# Altium project P-MT3620RDB-1-7.PrjPcb (part 4 of 5)
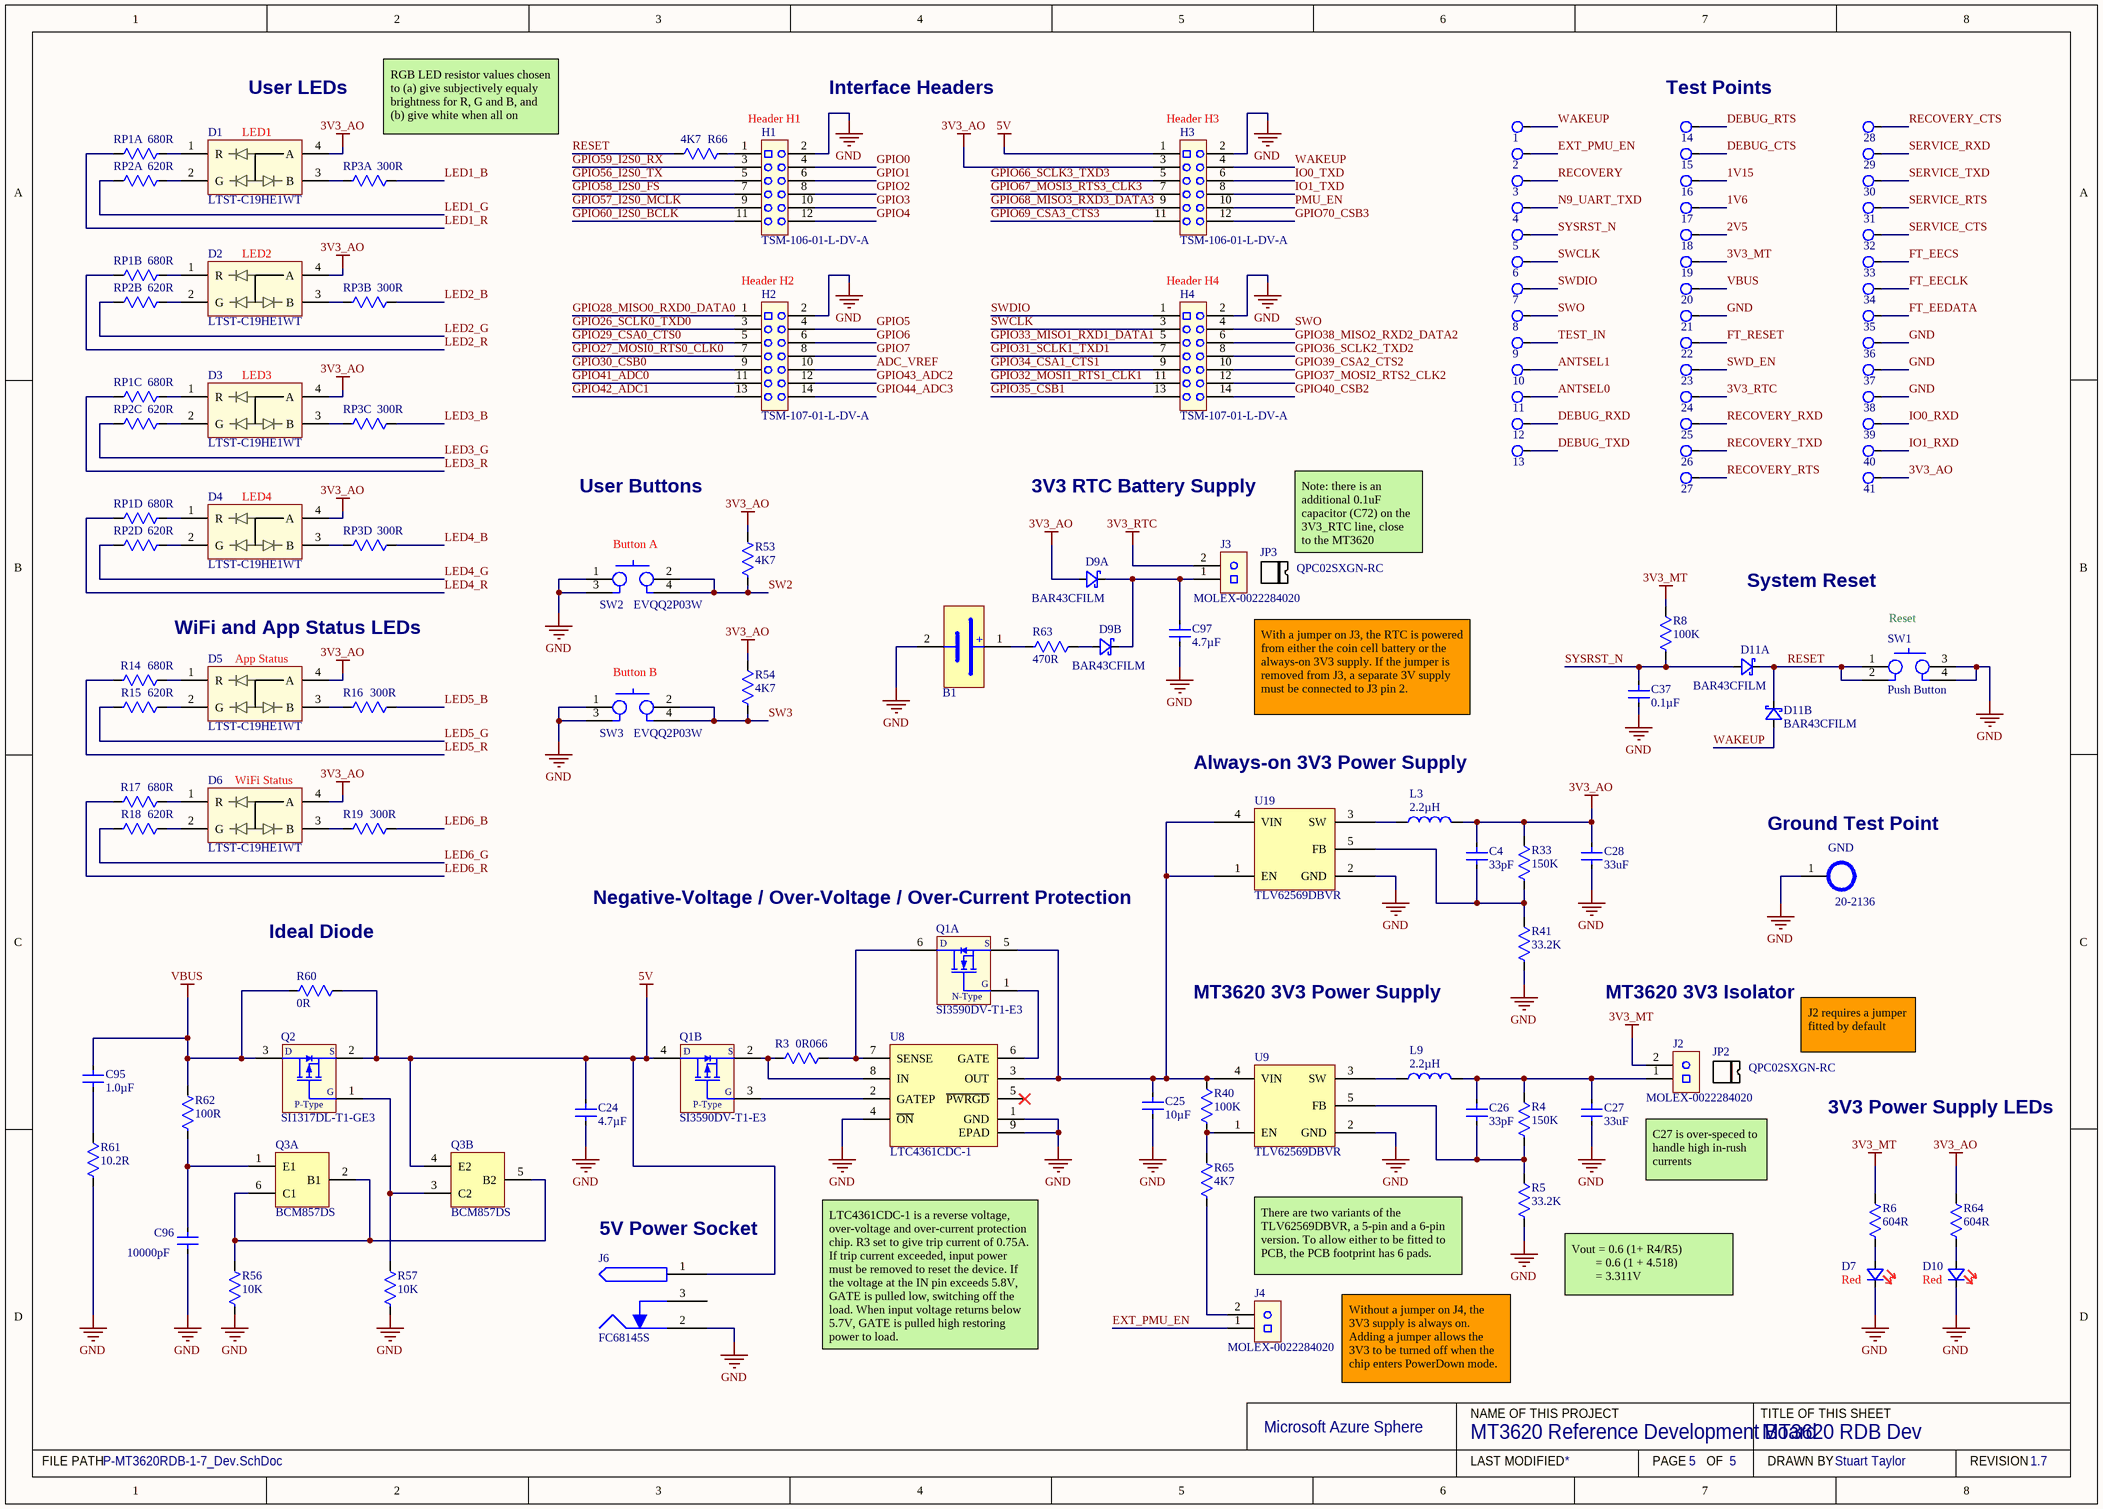
[diagram p6: P-MT3620RDB-1-7_Dev.SchDoc]

## Sheet P-MT3620RDB-1-7_Dev.SchDoc: MT3620 RDB Dev (continued)

### Library data of the parts
1-41 = TestPoint: Test Point
B1 = HARWIN-S8421-45R: SMT CR2032 coin cell holder; Manufacturer: HARWIN; Battery Sizes Accepted: 20; No. of Batteries: 1; Battery Holder Mount: SMD; Battery Terminals: Pressure Contact; SVHC: No SVHC (20-Jun-2013); For Use With: CR2032 Coin Cell Batteries; Battery Type, Function: Coin Cell, Holder; Style: Holder (Open); Battery Cell Size: Coin, 20.0mm; Battery Series: 2032; Supplier 1: Farnell; Manufacturer Part Number: S8421-45R; RoHS: YES; Stock 1: 522; Pricing 1: 1=1.45, 10=1.19, 25=0.98, 50=0.89, 100=0.78 (GBP); Accessory Type: Coin Cell Holder; ComponentLink1URL: http://www.harwin.com/include/downloads/drawings/S8421R.PDF; ComponentLink1Description: http://www.harwin.com/include/downloads/drawings/S8421R.PDF; Supplier Part Number 1: 2115305; Supplier 2: Digi-Key; Category: Battery Products; Stock 2: 3868; Pricing 2: 1=0.69, 10=0.619, 50=0.5498, 100=0.4811, 250=0.43988 (GBP); Number of Cells: 1; Mounting Type: PCB, Surface Mount; Termination Style: SMD (SMT) Tab; Height Above Board: 0.185" (4.70mm); Operating Temperature: -40°C ~ 105°C; ComponentLink2URL: http://harwin.com/includes/pdfs/S8421R.pdf; ComponentLink2Description: http://harwin.com/includes/pdfs/S8421R.pdf; Supplier Part Number 2: 952-1737-1-ND
C4 C26 = 33pF 0402 C0G, NP0 50V: CAP CER 33PF 50V 5% NP0 0402; Manufacturer: TDK Corporation; Manufacturer Part Number: C1005C0G1H330J050BA; Supplier 1: Digi-Key; RoHS: RoHS Compliant; Category: Capacitors; Stock 1: 47833; Pricing 1: 0.00274; Packaging: Tape & Reel (TR); Tolerance: ±5%; Voltage - Rated: 50V; Temperature Coefficient: C0G, NP0; Mounting Type: Surface Mount, MLCC; Operating Temperature: -55°C ~ 125°C; Applications: General Purpose; Package / Case: 0402 (1005 Metric); Size / Dimension: 0.039" L x 0.020" W (1.00mm x 0.50mm); Height - Seated (Max): -; Thickness (Max): 0.022" (0.55mm); Lead Spacing: -; Features: -; Lead Style: -; ComponentLink1URL: http://product.tdk.com/en/catalog/datasheets/mlcc_commercial_general_en.pdf; ComponentLink1Description: http://product.tdk.com/en/catalog/datasheets/mlcc_commercial_general_en.pdf; Supplier Part Number 1: 445-1241-2-ND; Ratings: -; Capacitance: 33pF
C24 C97 = 4.7µF 0402 X5R 10V: CAP CER 4.7UF 10V 10% X5R 0402; Manufacturer: TDK Corporation; Manufacturer Part Number: C1005X5R1A475K050BC; Supplier 1: Digi-Key; RoHS: RoHS Compliant; Category: Capacitors; Stock 1: 47833; Pricing 1: 0.06265; Packaging: Tape & Reel (TR); Tolerance: ±10%; Voltage - Rated: 10V; Temperature Coefficient: X5R; Mounting Type: Surface Mount, MLCC; Operating Temperature: -55°C ~ 125°C; Applications: General Purpose; Package / Case: 0402 (1005 Metric); Size / Dimension: 0.039" L x 0.020" W (1.00mm x 0.50mm); Height - Seated (Max): -; Thickness (Max): 0.022" (0.55mm); Lead Spacing: -; Features: -; Lead Style: -; ComponentLink1URL: http://product.tdk.com/en/catalog/datasheets/mlcc_commercial_general_en.pdf; ComponentLink1Description: http://product.tdk.com/en/catalog/datasheets/mlcc_commercial_general_en.pdf; Supplier Part Number 1: 445-13820-2-ND; Ratings: -; Capacitance: 4.7µF
C25 = 10µF 0603 X5R 25V: CAP CER 10UF 25V 20% X5R 0603; Manufacturer: TDK Corporation; Manufacturer Part Number: C1608X5R1E106M080AC; Supplier 1: Digi-Key; RoHS: RoHS Compliant; Category: Capacitors; Stock 1: 47833; Pricing 1: 0.00754; Packaging: Tape & Reel (TR); Tolerance: ±20%; Voltage - Rated: 25V; Temperature Coefficient: X5R; Mounting Type: Surface Mount, MLCC; Operating Temperature: -55°C ~ 125°C; Applications: General Purpose; Package / Case: 0603 (1608 Metric); Size / Dimension: 0.063" L x 0.031" W (1.60mm x 0.80mm); Height - Seated (Max): -; Thickness (Max): 0.039" (1.00mm); Lead Spacing: -; Features: -; Lead Style: -; ComponentLink1URL: http://product.tdk.com/en/catalog/datasheets/mlcc_commercial_general_en.pdf; ComponentLink1Description: http://product.tdk.com/en/catalog/datasheets/mlcc_commercial_general_en.pdf; Supplier Part Number 1: 445-9015-2-ND; Ratings: -; Capacitance: 10µF
C27 C28 = 33uF 0805 X5R 6.3V: CAP CER 33UF 6.3V X5R 0805; Manufacturer: TDK; Manufacturer Part Number: C2012X5R0J336M125AC; Dielectric Material: Ceramic; Tolerance: 20%; Supplier 1: Digi-Key; Stock 1: 11984; Pricing 1: 1=0.87, 10=0.658, 100=0.4706, 500=0.3643, 1000=0.3137 (USD); Mount: Surface Mount; Case/Package: 0805; Weight: 0.000194oz; Case Code (Imperial): 0805; Case Code (Metric): 2012; Min Operating Temperature: -55°C; Max Operating Temperature: 85°C; Capacitance: 33uF; Voltage Rating (DC): 6.3V; Packaging: Tape and Reel; Package Quantity: 1; Voltage Rating: 6.3V; Dielectric: X5R; Termination: SMD/SMT; Composition: Ceramic; Length: 2mm; Height: 1.25mm; Width: 1.2mm; Thickness: 0.057inch; Depth: 1.25mm; Radiation Hardening: No; REACH SVHC: No SVHC; Lead Free: Lead Free; ComponentLink1URL: https://datasheet.ciiva.com/24217/c2012x5r0j336m125ac-265107-24217265.pdf; ComponentLink1Description: https://datasheet.ciiva.com/24217/c2012x5r0j336m125ac-265107-24217265.pdf; ComponentLink2URL: https://datasheet.ciiva.com/17487/e412-c-17487404.pdf; ComponentLink2Description: https://datasheet.ciiva.com/17487/e412-c-17487404.pdf; ComponentLink3URL: https://datasheet.ciiva.com/6285/tdkmlcccaprange-6285867.pdf; ComponentLink3Description: https://datasheet.ciiva.com/6285/tdkmlcccaprange-6285867.pdf; ComponentLink4URL: https://datasheet.ciiva.com/6285/tdkmlcccaprange-6285863.pdf; ComponentLink4Description: https://datasheet.ciiva.com/6285/tdkmlcccaprange-6285863.pdf; Supplier Part Number 1: 445-5986-6-ND
C37 = 0.1µF 0402 X7R 50V: CAP CER 0.1UF 50V 10% X7R 0402; Manufacturer: TDK Corporation; Manufacturer Part Number: C1005X7R1H104K050BB; Supplier 1: Digi-Key; RoHS: RoHS Compliant; Category: Capacitors; Stock 1: 47833; Pricing 1: 0.01305; Packaging: Tape & Reel (TR); Tolerance: ±10%; Voltage - Rated: 50V; Temperature Coefficient: X7R; Mounting Type: Surface Mount, MLCC; Operating Temperature: -55°C ~ 125°C; Applications: General Purpose; Package / Case: 0402 (1005 Metric); Size / Dimension: 0.039" L x 0.020" W (1.00mm x 0.50mm); Height - Seated (Max): -; Thickness (Max): 0.022" (0.55mm); Lead Spacing: -; Features: -; Lead Style: -; ComponentLink1URL: http://product.tdk.com/en/catalog/datasheets/mlcc_commercial_general_en.pdf; ComponentLink1Description: http://product.tdk.com/en/catalog/datasheets/mlcc_commercial_general_en.pdf; Supplier Part Number 1: 445-5932-2-ND; Ratings: -; Capacitance: 0.1µF
C95 = 1.0µF 0402 X5R 35V: CAP CER 1UF 35V 10% X5R 0402; Manufacturer: TDK Corporation; Manufacturer Part Number: C1005X5R1V105K050BC; Supplier 1: Digi-Key; RoHS: RoHS Compliant; Category: Capacitors; Stock 1: 47833; Pricing 1: 0.0186; Packaging: Tape & Reel (TR); Tolerance: ±10%; Voltage - Rated: 35V; Temperature Coefficient: X5R; Mounting Type: Surface Mount, MLCC; Operating Temperature: -55°C ~ 125°C; Applications: General Purpose; Package / Case: 0402 (1005 Metric); Size / Dimension: 0.039" L x 0.020" W (1.00mm x 0.50mm); Height - Seated (Max): -; Thickness (Max): 0.022" (0.55mm); Lead Spacing: -; Features: -; Lead Style: -; ComponentLink1URL: http://product.tdk.com/en/catalog/datasheets/mlcc_commercial_general_en.pdf; ComponentLink1Description: http://product.tdk.com/en/catalog/datasheets/mlcc_commercial_general_en.pdf; Supplier Part Number 1: 445-9073-2-ND; Ratings: -; Capacitance: 1.0µF
C96 = 10000pF 0402 X7R 50V: CAP CER 10000PF 50V 10% X7R 0402; Manufacturer: TDK Corporation; Manufacturer Part Number: C1005X7R1H103K050BB; Supplier 1: Digi-Key; RoHS: RoHS Compliant; Category: Capacitors; Stock 1: 47833; Pricing 1: 0.00685; Packaging: Tape & Reel (TR); Tolerance: ±10%; Voltage - Rated: 50V; Temperature Coefficient: X7R; Mounting Type: Surface Mount, MLCC; Operating Temperature: -55°C ~ 125°C; Applications: General Purpose; Package / Case: 0402 (1005 Metric); Size / Dimension: 0.039" L x 0.020" W (1.00mm x 0.50mm); Height - Seated (Max): -; Thickness (Max): 0.022" (0.55mm); Lead Spacing: -; Features: -; Lead Style: -; ComponentLink1URL: http://product.tdk.com/en/catalog/datasheets/mlcc_commercial_general_en.pdf; ComponentLink1Description: http://product.tdk.com/en/catalog/datasheets/mlcc_commercial_general_en.pdf; Supplier Part Number 1: 445-6850-2-ND; Ratings: -; Capacitance: 10000pF
D1-D6 = LTST-C19HE1WT: LED RGB DIFFUSED 0606 SMD; Manufacturer: Lite-On Inc.; Color: Red, Green, Blue (RGB); Lens Color: White; Millicandela Rating: 112.5mcd Red, 281mcd Green, 104mcd Blue; Lens Style/Size: Rectangle with Flat Top, 1.15mm x 1.60mm; Voltage - Forward (Vf) (Typ): 2.1V Red, 3.35V Green, 3.35V Blue; Current - Test: 20mA Red, 20mA Green, 20mA Blue; Viewing Angle: 130°; Wavelength - Dominant: 624nm Red, 525nm Green, 470nm Blue; Wavelength - Peak: 632nm Red, 520nm Green, 468nm Blue; Supplier 1: Digi-Key; Manufacturer Part Number: LTST-C19HE1WT; RoHS: RoHS Compliant; Category: Optoelectronics; Stock 1: 464778; Pricing 1: 1=0.45, 10=0.32, 25=0.2616, 100=0.2093, 250=0.17664, 500=0.15048, 1000=0.11776 (GBP); Packaging: Cut Tape (CT); Part Status: Active; Lens Transparency: Diffused; Mounting Type: Surface Mount; Features: -; Package / Case: 0606 (1616 Metric); Supplier Device Package: *; Size / Dimension: 1.60mm L x 1.60mm W; Height (Max): 0.35mm; ComponentLink1URL: http://optoelectronics.liteon.com/upload/download/DS22-2008-0044/S_110_LTST-C19HE1WT.pdf; ComponentLink1Description: http://optoelectronics.liteon.com/upload/download/DS22-2008-0044/S_110_LTST-C19HE1WT.pdf; Supplier Part Number 1: 160-2162-1-ND
D7 D10 = SML-D12U: 1.6 x 0.8 x 0.55mm (0603) LED 620nm Red; Manufacturer: Rohm Semiconductor; Manufacturer Part Number: SML-D12U8WT86; Millicandela Rating: 63mcd; Voltage - Forward (Vf) (Typ): 2.2V; Current - Test: 20mA; Lens Type: Diffused, White; Lens Style/Size: Rectangle with Flat Top, 1.2mm x 0.8mm; Supplier 1: Digi-Key; RoHS: RoHS Compliant; Category: Optoelectronics; Stock 1: 5722; Pricing 1: 1=0.38, 10=0.279, 25=0.2232, 100=0.1478, 250=0.1046, 500=0.08926, 1000=0.06974 (GBP); Packaging: Cut Tape (CT); Wavelength - Dominant: 620nm; Wavelength - Peak: -; Viewing Angle: -; Package / Case: 0603 (1608 Metric); Size / Dimension: 1.60mm L x 0.80mm W; Height: 0.55mm; Mounting Type: Surface Mount; Luminous Flux @ Current - Test: -; ComponentLink1URL: http://rohmfs.rohm.com/en/products/databook/datasheet/opto/led/chip_mono/sml-d1.pdf; ComponentLink1Description: http://rohmfs.rohm.com/en/products/databook/datasheet/opto/led/chip_mono/sml-d1.pdf; Supplier 2: Farnell; Supplier Part Number 1: 511-1580-1-ND; Supplier Part Number 2: 1685094
D9 D11 = BAR43CFILM: DIODE ARRAY SCHOTTKY 30V SOT23-3; Manufacturer: STMicroelectronics; Element Configuration: Common Cathode; Forward Current: 100mA; Peak Reverse Current: 500nA; Forward Voltage: 1V; Reverse Recovery Time: 5ns; Max Forward Surge Current (Ifsm): 750mA; Power Dissipation: 250mW; Capacitance: 7pF; Supplier 1: Farnell; Manufacturer Part Number: BAR43CFILM; Stock 1: 0; Mount: Surface Mount; Case/Package: SOT-23; Number of Pins: 3; Weight: 0.01lb; Contact Plating: Matte,Tin; Min Operating Temperature: -65°C; Max Operating Temperature: 150°C; Packaging: Tape and Reel; Package Quantity: 3000; Max Repetitive Reverse Voltage (Vrrm): 30V; Average Rectified Current: 100mA; Termination: SMD/SMT; Peak Non-Repetitive Surge Current: 750mA; Current Rating: 100mA; Voltage Rating (DC): 30V; Max Reverse Voltage (DC): 30V; Length: 2.9mm; Height: 0.95mm; Width: 3.05mm; Radiation Hardening: No; REACH SVHC: No SVHC; Lead Free: Lead Free; ComponentLink1URL: http://www.farnell.com/datasheets/1700360.pdf; ComponentLink1Description: http://www.farnell.com/datasheets/1700360.pdf; ComponentLink2URL: http://www.jameco.com/Jameco/Products/ProdDS/869700.pdf; ComponentLink2Description: http://www.jameco.com/Jameco/Products/ProdDS/869700.pdf; ComponentLink3URL: http://www.alliedelec.com/images/products/datasheets/bm/STMICROELECTRONICS/70013844.pdf; ComponentLink3Description: http://www.alliedelec.com/images/products/datasheets/bm/STMICROELECTRONICS/70013844.pdf; ComponentLink4URL: http://www.farnell.com/datasheets/1837092.pdf; ComponentLink4Description: http://www.farnell.com/datasheets/1837092.pdf; ComponentLink5URL: http://www.st.com/content/ccc/resource/technical/document/datasheet/b3/b4/6e/ab/17/40/40/62/CD00000764.pdf/files/CD00000764.pdf/jcr:content/translations/en.CD00000764.pdf; ComponentLink5Description: http://www.st.com/content/ccc/resource/technical/document/datasheet/b3/b4/6e/ab/17/40/40/62/CD00000764.pdf/files/CD00000764.pdf/jcr:content/translations/en.CD00000764.pdf; ComponentLink6URL: http://www.st.com/web/en/resource/technical/document/datasheet/CD00000764.pdf; ComponentLink6Description: http://www.st.com/web/en/resource/technical/document/datasheet/CD00000764.pdf; Supplier Part Number 1: 1562326RL
GND = 20-2136: VERO - 20-2136 - TERMINAL, PCB, BLACK, PK100; Product Range: Type 8 Series; Connector Mounting: Through Hole Mount; Mounting Hole Dia: 1.32; SVHC: No SVHC (17-Dec-2015); Body Height Max: 3.1; Body Height Min: 2.9; External Length / Height: 8.7; Lead Length: 3.4; Panel Thickness: 1.6mm<!--FANDB--><div class="features-and-benefits-container"><div class="features-and-benefits-description"><span class="features-benefits-value">The 20-2136 from Vero is a black bead terminal assembly for 1.32mm hole size. This PCB test point is used for attaching leads to test scopes and probes with scintered glass insulator. The compliant pin design allows terminal to be inserted without damaging hole plating. The terminal will remain in place even when the board is inverted for soldering. The sintered glass bead has a recommended maximum working temperature of 475°C. This exceeds all current standard temperature profile requirements.</span></div><div class="features-and-benefits-list"><ul class="features-and-benefits-list-list"><li class="features-and-benefits-list-item">Used for 1.6; Supplier 1: Farnell; Manufacturer: VERO; Manufacturer Part Number: 20-2136; RoHS: YES; Stock 1: 960; Pricing 1: 100=0.1129, 500=0.1073, 1000=0.1016, 5000=0.096, 10000=0.0903 (GBP); Connector Colour: Black; Contact Material: Phosphor Bronze; Contact Plating: Tin Plated Contacts; Colour: Black; Material: Glass; PCB Hole Diameter: 1.32; ComponentLink1URL: http://www.farnell.com/datasheets/1697168.pdf; ComponentLink1Description: http://www.farnell.com/datasheets/1697168.pdf; Supplier Part Number 1: 8731195
H1 H3 = TSM-106-01-L-DV-A: CONN HEADER 12POS .100" SMD GOLD; Manufacturer: Samtec; Number of Contacts: 12; Connector Type: Solder; Gender: Male; Max Current Rating: 7A; Max Voltage Rating (AC): 475V; Pitch: 2.54mm; Supplier 1: Digi-Key; Manufacturer Part Number: TSM-106-01-L-DV-A; Stock 1: 294; Pricing 1: 1=1.92, 10=1.74, 100=1.491, 500=1.2425, 1000=1.065, 5000=0.9443, 10000=0.923 (USD); Case/Package: SMD/SMT; Contact Plating: Nickel,Gold; Contact Material: Bronze; Housing Colour: Black; Housing Material: Polymer; Min Operating Temperature: -55°C; Max Operating Temperature: 125°C; Number of Rows: 2; Termination: Solder; Packaging: Rail/Tube; Orientation: Straight; Length: 15.24mm; Depth: 5.08mm; Radiation Hardening: No; Lead Free: Lead Free; ComponentLink1URL: http://components.arrow.com/part/dataview/0323_01322952; ComponentLink1Description: http://components.arrow.com/part/dataview/0323_01322952; ComponentLink2URL: http://www.samtec.com/documents/webfiles/pdf/TSM.PDF; ComponentLink2Description: http://www.samtec.com/documents/webfiles/pdf/TSM.PDF; Supplier Part Number 1: SAM12240-ND
H2 H4 = TSM-107-01-L-DV-A: CONN HEADER 14POS .100" SMD GOLD; Manufacturer: Samtec; Number of Contacts: 14; Connector Type: Male Pin; Max Current Rating: 7A; Max Voltage Rating (AC): 475V; Pitch: 2.54mm; Row Spacing: 0.1inch; Supplier 1: Digi-Key; Manufacturer Part Number: TSM-107-01-L-DV-A; Stock 1: 450; Pricing 1: 1=2.14, 10=1.938, 100=1.6611, 500=1.3843, 1000=1.1865, 5000=1.052 (USD); Mount: Surface Mount; Case/Package: 100; Contact Plating: Nickel,Gold; Contact Material: Bronze; Housing Colour: Black; Housing Material: Polymer; Colour: Black; Min Operating Temperature: -55°C; Max Operating Temperature: 125°C; Number of Rows: 2; Termination: Solder; Packaging: Rail/Tube; Orientation: Straight; Number of Positions: 14; Length: 17.78mm; Depth: 5.08mm; Contact Mating Length: 0.23inch; Lead Free: Lead Free; ComponentLink1URL: https://datasheet.ciiva.com/739/tsm-1xx-xx-xxx-xx-x-xxx-x-mkt-739691.pdf; ComponentLink1Description: https://datasheet.ciiva.com/739/tsm-1xx-xx-xxx-xx-x-xxx-x-mkt-739691.pdf; Supplier Part Number 1: SAM10809-ND
J2-J4 = MOLEX-0022284020: CONN HEADER 2POS .100 VERT TIN; Manufacturer: Molex, LLC; Connector Type: Header, Unshrouded, Breakaway; Number of Positions: 2; Number of Positions Loaded: All; Pitch: 0.100" (2.54mm); Supplier 1: Digi-Key; Manufacturer Part Number: 0022284020; RoHS: RoHS Compliant; Category: Connectors, Interconnects; Stock 1: 10077; Pricing 1: 1=0.12, 10=0.108, 25=0.0808, 50=0.0692, 100=0.0668, 250=0.0576, 500=0.0553 (GBP); Packaging: Bulk; Contact Type: Male Pin; Number of Rows: 1; Row Spacing: -; Contact Mating Length: 0.240" (6.10mm); Mounting Type: Through Hole; Termination: Solder; Fastening Type: -; Features: -; Contact Finish: Tin; Contact Finish Thickness: 100µin (2.54µm); Color: Black; ComponentLink1URL: http://www.molex.com/pdm_docs/sd/022284020_sd.pdf; ComponentLink1Description: http://www.molex.com/pdm_docs/sd/022284020_sd.pdf; Supplier Part Number 1: WM50014-02-ND
J6 = FC68145S: CLIFF ELECTRONIC COMPONENTS, FC68145S, DC Power Connector, Jack, 1 A, 1.3 mm, Surface Mount; Current Rating: 1A; Pin Diameter: 1.3mm; Barrel Outer Diameter: 3.7mm; Voltage Rating: 12V; SVHC: No SVHC (17-Dec-2015); Supplier 1: Farnell; Manufacturer: Cliff; Manufacturer Part Number: FC68145S; Stock 1: 1068; Pricing 1: 1=1.87, 25=1.17, 50=0.917, 150=0.823, 250=0.736, 500=0.674, 1500=0.571, 2500=0.509 (EUR); Gender: Jack; Barrel Length: -; Connector Mounting: Surface Mount; Contact Termination Type: Surface Mount; Barrel Inner Diameter: -; Product Range: -; ComponentLink1URL: https://datasheet.ciiva.com/6838/1303385-6838100.pdf; ComponentLink1Description: https://datasheet.ciiva.com/6838/1303385-6838100.pdf; ComponentLink2URL: https://datasheet.ciiva.com/7653/1864271-7653766.pdf; ComponentLink2Description: https://datasheet.ciiva.com/7653/1864271-7653766.pdf; Supplier Part Number 1: 1889307
JP2 JP3 = QPC02SXGN-RC: CONN JUMPER SHORTING .100" GOLD; Manufacturer: Sullins; Number of Positions: 2; Pitch: 0.1inch; Supplier 1: Digi-Key; Manufacturer Part Number: QPC02SXGN-RC; RoHS: Yes; Category: Connectors; Stock 1: 717508; Pricing 1: 1=0.10000, 10=0.05900, 25=0.04400, 50=0.03780, 100=0.03650, 250=0.03152, 500=0.03024, 1000=0.02646, 2500=0.02394 (USD); Case/Package: 100; Contact Plating: Gold; Package Quantity: 2000; Packaging: Bulk; Height: 0.235inch; Lead Free: Lead Free; ComponentLink1URL: https://datasheet.ciiva.com/767/284-sxgn-11510-767869.pdf?src-supplier=Digi-Key; ComponentLink1Description: https://datasheet.ciiva.com/767/284-sxgn-11510-767869.pdf?src-supplier=Digi-Key; Supplier Part Number 1: S9337-ND
L3 L9 = NR3015T2R2M: FIXED IND 2.2UH 1.5A 72 MOHM SMD; Manufacturer: Taiyo Yuden; Type: Wirewound; Material - Core: Ferrite; Tolerance: ±20%; Current - Saturation: 1.48A; Shielding: Shielded; DC Resistance (DCR): 72 mOhm Max; Frequency - Self Resonant: 64MHz; Frequency - Test: 100kHz; Supplier 1: Digi-Key; Manufacturer Part Number: NR3015T2R2M; RoHS: RoHS Compliant; Category: Inductors, Coils, Chokes; Stock 1: 150589; Pricing 1: 1=0.23, 10=0.209, 25=0.1864, 50=0.163, 100=0.1513, 250=0.13964, 500=0.13268, 1000=0.10707 (GBP); Packaging: Cut Tape (CT); Inductance: 2.2µH; Current Rating: 1.5A; Q @ Freq: -; Ratings: -; Operating Temperature: -25°C ~ 120°C; Mounting Type: Surface Mount; Package / Case: Nonstandard; Size / Dimension: 0.118" L x 0.118" W (3.00mm x 3.00mm); Height - Seated (Max): 0.059" (1.50mm); ComponentLink1URL: http://ds.yuden.co.jp/TYCOMPAS/ut/detail.do?productNo=NR3015T2R2M&fileName=NR3015T2R2M_SS&mode=specSheetDownload; ComponentLink1Description: http://ds.yuden.co.jp/TYCOMPAS/ut/detail.do?productNo=NR3015T2R2M&fileName=NR3015T2R2M_SS&mode=specSheetDownload; Supplier Part Number 1: 587-1648-1-ND
Q1 = SI3590DV-T1-E3: MOSFET N&P-CH 30V (D-S); Manufacturer: Vishay Siliconix; Nominal Vgs: 600mV; Rds On Max: 77mR; Rise Time: 15ns; Continuous Drain Current (ID): 2.5A; Max Power Dissipation: 830mW; Drain to Source Resistance: 170mR; Gate to Source Voltage (Vgs): 12V; Turn-Off Delay Time: 20ns; Number of Elements: 2; Turn-On Delay Time: 5ns; Supplier 1: Digi-Key; Manufacturer Part Number: SI3590DV-T1-E3; Stock 1: 43293; Pricing 1: 1=0.71, 10=0.612, 25=0.5712, 100=0.4568, 250=0.4242, 500=0.3589, 1000=0.2774 (USD); Mount: Surface Mount; Case/Package: TSOP; Number of Pins: 6; Weight: 0.000705oz; Min Operating Temperature: -55°C; Max Operating Temperature: 150°C; Packaging: Tape and Reel; Package Quantity: 3000; Drain to Source Voltage (Vdss): 30V; Drain to Source Breakdown Voltage: 30V; Fall Time: 15ns; Power Dissipation: 830mW; Number of Channels: 2; Length: 3.05mm; Height: 1mm; Width: 1.65mm; Radiation Hardening: No; REACH SVHC: Unknown; Lead Free: Lead Free; ComponentLink1URL: https://datasheet.ciiva.com/4441/72032-244663-4441688.pdf; ComponentLink1Description: https://datasheet.ciiva.com/4441/72032-244663-4441688.pdf; ComponentLink2URL: https://datasheet.ciiva.com/11158/72032-11158835.pdf; ComponentLink2Description: https://datasheet.ciiva.com/11158/72032-11158835.pdf; ComponentLink3URL: https://datasheet.ciiva.com/6388/72032-6388120.pdf; ComponentLink3Description: https://datasheet.ciiva.com/6388/72032-6388120.pdf; ComponentLink4URL: https://datasheet.ciiva.com/6388/72032-6388117.pdf; ComponentLink4Description: https://datasheet.ciiva.com/6388/72032-6388117.pdf; ComponentLink5URL: https://datasheet.ciiva.com/26145/72032-26145319.pdf; ComponentLink5Description: https://datasheet.ciiva.com/26145/72032-26145319.pdf; Supplier Part Number 1: SI3590DV-T1-E3DKR-ND
Q2 = SI1317DL-T1-GE3: VISHAY SI1317DL-T1-GE3 MOSFET Transistor, P Channel, -1.4 A, -20 V, 0.125 ohm, -4.5 V, 450 mV; Manufacturer: Vishay Siliconix; Rds On Max: 150mR; Input Capacitance: 272pF; Rise Time: 30ns; Drain to Source Voltage (Vdss): 20V; Continuous Drain Current (ID): 1.4A; Max Power Dissipation: 500mW; Number of Channels: 1; Drain to Source Resistance: 270mR; Gate to Source Voltage (Vgs): 8V; Fall Time: 18ns; Turn-Off Delay Time: 23ns; Turn-On Delay Time: 12ns; Threshold Voltage: 450mV; Power Dissipation: 400mW; Element Configuration: Single; Supplier 1: Digi-Key; Manufacturer Part Number: SI1317DL-T1-GE3; Stock 1: 79243; Pricing 1: 1=0.55, 10=0.433, 100=0.2974, 500=0.2039, 1000=0.153 (USD); Mount: Surface Mount; Case/Package: SOT-323-3; Number of Pins: 3; Weight: 0.004395oz; Contact Plating: Tin,Matte; Min Operating Temperature: -50°C; Max Operating Temperature: 150°C; Package Quantity: 3000; Packaging: Tape and Reel; Drain to Source Breakdown Voltage: 20V; Number of Elements: 1; Radiation Hardening: No; REACH SVHC: No SVHC; Lead Free: Lead Free; ComponentLink1URL: https://datasheet.ciiva.com/29746/si1317dl-29746785.pdf; ComponentLink1Description: https://datasheet.ciiva.com/29746/si1317dl-29746785.pdf; ComponentLink2URL: https://datasheet.ciiva.com/11158/si1317dl-11158622.pdf; ComponentLink2Description: https://datasheet.ciiva.com/11158/si1317dl-11158622.pdf; ComponentLink3URL: https://datasheet.ciiva.com/28424/si1317dl-28424683.pdf; ComponentLink3Description: https://datasheet.ciiva.com/28424/si1317dl-28424683.pdf; Supplier Part Number 1: SI1317DL-T1-GE3CT-ND
Q3 = BCM857DS,115: BJT ARRAY, DUAL PNP, -45V, -100MA, 6-SOT-457; Manufacturer: NXP Semiconductors; Max Power Dissipation: 380mW; Collector Emitter Voltage (VCEO): 45V; Collector Base Voltage (VCBO): 50V; Max Collector Current: 100mA; Emitter Base Voltage (VEBO): 5V; Gain Bandwidth Product: 175MHz; Number of Elements: 2; Tolerance: 5%; Test Current: 5mA; Zener Voltage: 3.3V; Supplier 1: Digi-Key; Manufacturer Part Number: BCM857DS,115; Stock 1: 369; Pricing 1: 1=0.46, 10=0.343, 100=0.2137, 500=0.1462, 1000=0.1125 (USD); Mount: Surface Mount; Case/Package: SOT-457; Number of Pins: 6; Weight: 0.01lb; Contact Plating: Tin; Min Operating Temperature: -65°C; Max Operating Temperature: 150°C; Packaging: Tape and Reel; Package Quantity: 1; Polarity: PNP; Element Configuration: Dual; Frequency: 175MHz; Collector Emitter Breakdown Voltage: 45V; Transition Frequency: 175MHz; Max Breakdown Voltage: 45V; Power Dissipation: 380mW; Length: 0.25inch; Height: 0.25inch; Width: 0.25inch; Radiation Hardening: No; REACH SVHC: No SVHC; Lead Free: Lead Free; ComponentLink1URL: https://datasheet.ciiva.com/11204/bcm857bv-bs-ds-11204112.pdf; ComponentLink1Description: https://datasheet.ciiva.com/11204/bcm857bv-bs-ds-11204112.pdf; ComponentLink2URL: https://datasheet.ciiva.com/4721/bcm857bv-bs-ds-5-75887-4721904.pdf; ComponentLink2Description: https://datasheet.ciiva.com/4721/bcm857bv-bs-ds-5-75887-4721904.pdf; ComponentLink3URL: https://datasheet.ciiva.com/6366/bcm857bv-bs-ds-6366029.pdf; ComponentLink3Description: https://datasheet.ciiva.com/6366/bcm857bv-bs-ds-6366029.pdf; ComponentLink4URL: https://datasheet.ciiva.com/6366/bcm857bv-bs-ds-6366027.pdf; ComponentLink4Description: https://datasheet.ciiva.com/6366/bcm857bv-bs-ds-6366027.pdf; ComponentLink5URL: https://datasheet.ciiva.com/46397/661087-46397258.pdf; ComponentLink5Description: https://datasheet.ciiva.com/46397/661087-46397258.pdf; ComponentLink6URL: https://datasheet.ciiva.com/16614/bcm857bv-bs-ds-16614863.pdf; ComponentLink6Description: https://datasheet.ciiva.com/16614/bcm857bv-bs-ds-16614863.pdf; ComponentLink7URL: https://datasheet.ciiva.com/8061/661087-8061151.pdf; ComponentLink7Description: https://datasheet.ciiva.com/8061/661087-8061151.pdf; ComponentLink8URL: https://datasheet.ciiva.com/16421/bcm857bv-bs-ds-16421438.pdf; ComponentLink8Description: https://datasheet.ciiva.com/16421/bcm857bv-bs-ds-16421438.pdf; ComponentLink9URL: https://datasheet.ciiva.com/22711/661087-22711606.pdf; ComponentLink9Description: https://datasheet.ciiva.com/22711/661087-22711606.pdf; ComponentLink10URL: https://datasheet.ciiva.com/1258/661087-1258230.pdf; ComponentLink10Description: https://datasheet.ciiva.com/1258/661087-1258230.pdf; ComponentLink11URL: https://datasheet.ciiva.com/1259/bcm857bv-bs-ds-1259154.pdf; ComponentLink11Description: https://datasheet.ciiva.com/1259/bcm857bv-bs-ds-1259154.pdf; ComponentLink12URL: https://datasheet.ciiva.com/6366/bcm857bv-bs-ds-6366025.pdf; ComponentLink12Description: https://datasheet.ciiva.com/6366/bcm857bv-bs-ds-6366025.pdf; ComponentLink13URL: https://datasheet.ciiva.com/5747/661087-5747736.pdf; ComponentLink13Description: https://datasheet.ciiva.com/5747/661087-5747736.pdf; ComponentLink14URL: https://datasheet.ciiva.com/5747/661087-5747735.pdf; ComponentLink14Description: https://datasheet.ciiva.com/5747/661087-5747735.pdf; Supplier Part Number 1: 1727-4884-1-ND
R3 = WSLP0603R0660FEB: Current Sense Resistors - SMD .4watt .066ohm 1%; Manufacturer: Vishay Dale; Resistance: 0.066 Ohms; Power Rating: 400 mW; Temperature Coefficient: 75 PPM / C; Brand: Vishay / Dale; Unit Weight: 0.000071 oz; Supplier 1: Digikey; Manufacturer Part Number: WSLP0603R0660FEB; Stock 1: 2036; Pricing 1: 1=1.27, 10=1.125, 25=1.0344, 50=0.9438, 100=0.8168, 250=0.6897, 500=0.5808 (USD); Product Category: Current Sense Resistors - SMD; RoHS: True; Tolerance: 1 %; Technology: Metal Element; Case Code - in: 0603; Case Code - mm: 1608; Operating Temperature Range: - 65 C to + 170 C; Series: WSLP; Height: 0.33 mm; Length: 1.6 mm; Package / Case: 0603 (1608 metric); Packaging: Reel; Product: Metal Foil Current Sensing Resistors; Factory Pack Quantity: 1000; Termination Style: SMD/SMT; Tradename: Power Metal Strip; Type: Power Metal Strip Resistors, Very High Power (to 3 W), Low Value (down to 0.0005 Ohms), Surface Mount; Width: 0.8 mm; ComponentLink1URL: https://datasheet.ciiva.com/2504/wslp-2504594.pdf; ComponentLink1Description: https://datasheet.ciiva.com/2504/wslp-2504594.pdf; ComponentLink2URL: https://datasheet.ciiva.com/2504/wslp-2504593.pdf; ComponentLink2Description: https://datasheet.ciiva.com/2504/wslp-2504593.pdf; ComponentLink3URL: https://datasheet.ciiva.com/2504/wslp-2504592.pdf; ComponentLink3Description: https://datasheet.ciiva.com/2504/wslp-2504592.pdf; Supplier Part Number 1: WSLPA-.066DKR-ND
R4 R33 = 150K: RES 150K OHM 1/10W 1% 0402 SMD; Manufacturer: Panasonic Electronic Components; Manufacturer Part Number: ERJ-2RKF1503X; Power (Watts): 0.1W, 1/10W; Temperature Coefficient: ±100ppm/°C; Supplier 1: Digi-Key; Supplier Part Number 1: P150KLCT-ND; RoHS: RoHS Compliant; Category: Resistors; Stock 1: 330002; Pricing 1: 1=0.07, 50=0.0128, 100=0.0097, 250=0.0072, 500=0.00532, 1000=0.00355, 5000=0.0025 (GBP); Packaging: Cut Tape (CT); Tolerance: ±1%; Composition: Thick Film; Features: -; Package / Case: 0402 (1005 Metric); Supplier Device Package: 0402; Size / Dimension: 0.039" L x 0.020" W (1.00mm x 0.50mm); Height: 0.016" (0.40mm); Number of Terminations: 2; ComponentLink1URL: http://industrial.panasonic.com/www-cgi/jvcr13pz.cgi?E+PZ+3+AOA0002+ERJ2RKF1503X+7+WW; ComponentLink1Description: http://industrial.panasonic.com/www-cgi/jvcr13pz.cgi?E+PZ+3+AOA0002+ERJ2RKF1503X+7+WW; Resistance (Ohms): 150K
R5 R41 = 33.2K: RES 33.2K OHM 1/10W 1% 0402 SMD; Manufacturer: Panasonic Electronic Components; Manufacturer Part Number: ERJ-2RKF3322X; Power (Watts): 0.1W, 1/10W; Temperature Coefficient: ±100ppm/°C; Supplier 1: Digi-Key; Supplier Part Number 1: P33.2KLCT-ND; RoHS: RoHS Compliant; Category: Resistors; Stock 1: 313628; Pricing 1: 1=0.07, 50=0.0128, 100=0.0097, 250=0.0072, 500=0.00532, 1000=0.00355, 5000=0.0025 (GBP); Packaging: Cut Tape (CT); Tolerance: ±1%; Composition: Thick Film; Features: -; Package / Case: 0402 (1005 Metric); Supplier Device Package: 0402; Size / Dimension: 0.039" L x 0.020" W (1.00mm x 0.50mm); Height: 0.016" (0.40mm); Number of Terminations: 2; ComponentLink1URL: http://industrial.panasonic.com/www-cgi/jvcr13pz.cgi?E+PZ+3+AOA0002+ERJ2RKF3322X+7+WW; ComponentLink1Description: http://industrial.panasonic.com/www-cgi/jvcr13pz.cgi?E+PZ+3+AOA0002+ERJ2RKF3322X+7+WW; Resistance (Ohms): 33.2K
R6 R64 = 604R: RES 604 OHM 1/10W 1% 0402 SMD; Manufacturer: Panasonic Electronic Components; Manufacturer Part Number: ERJ-2RKF6040X; Power (Watts): 0.1W, 1/10W; Temperature Coefficient: ±100ppm/°C; Supplier 1: Digi-Key; Supplier Part Number 1: P604LCT-ND; RoHS: RoHS Compliant; Category: Resistors; Stock 1: 86930; Pricing 1: 1=0.07, 50=0.0128, 100=0.0097, 250=0.0072, 500=0.00532, 1000=0.00355, 5000=0.0025 (GBP); Packaging: Cut Tape (CT); Tolerance: ±1%; Composition: Thick Film; Features: -; Package / Case: 0402 (1005 Metric); Supplier Device Package: 0402; Size / Dimension: 0.039" L x 0.020" W (1.00mm x 0.50mm); Height: 0.016" (0.40mm); Number of Terminations: 2; ComponentLink1URL: http://industrial.panasonic.com/www-cgi/jvcr13pz.cgi?E+PZ+3+AOA0002+ERJ2RKF6040X+7+WW; ComponentLink1Description: http://industrial.panasonic.com/www-cgi/jvcr13pz.cgi?E+PZ+3+AOA0002+ERJ2RKF6040X+7+WW; Resistance (Ohms): 604R
R8 R40 = 100K: RES 100K OHM 1/10W 1% 0402 SMD; Manufacturer: Panasonic Electronic Components; Manufacturer Part Number: ERJ-2RKF1003X; Power (Watts): 0.1W, 1/10W; Temperature Coefficient: ±100ppm/°C; Supplier 1: Digi-Key; Supplier Part Number 1: P100KLCT-ND; RoHS: RoHS Compliant; Category: Resistors; Stock 1: 2310913; Pricing 1: 1=0.07, 50=0.0128, 100=0.0097, 250=0.0072, 500=0.00532, 1000=0.00355, 5000=0.0025 (GBP); Packaging: Cut Tape (CT); Tolerance: ±1%; Composition: Thick Film; Features: -; Package / Case: 0402 (1005 Metric); Supplier Device Package: 0402; Size / Dimension: 0.039" L x 0.020" W (1.00mm x 0.50mm); Height: 0.016" (0.40mm); Number of Terminations: 2; ComponentLink1URL: http://industrial.panasonic.com/www-cgi/jvcr13pz.cgi?E+PZ+3+AOA0002+ERJ2RKF1003X+7+WW; ComponentLink1Description: http://industrial.panasonic.com/www-cgi/jvcr13pz.cgi?E+PZ+3+AOA0002+ERJ2RKF1003X+7+WW; Resistance (Ohms): 100K
R14 R17 = 680R: RES 680 OHM 1/10W 1% 0402 SMD; Manufacturer: Panasonic Electronic Components; Manufacturer Part Number: ERJ-2RKF6800X; Power (Watts): 0.1W, 1/10W; Temperature Coefficient: ±100ppm/°C; Supplier 1: Digi-Key; Supplier Part Number 1: P680LCT-ND; RoHS: RoHS Compliant; Category: Resistors; Stock 1: 178651; Pricing 1: 1=0.07, 50=0.0128, 100=0.0097, 250=0.0072, 500=0.00532, 1000=0.00355, 5000=0.0025 (GBP); Packaging: Cut Tape (CT); Tolerance: ±1%; Composition: Thick Film; Features: -; Package / Case: 0402 (1005 Metric); Supplier Device Package: 0402; Size / Dimension: 0.039" L x 0.020" W (1.00mm x 0.50mm); Height: 0.016" (0.40mm); Number of Terminations: 2; ComponentLink1URL: http://industrial.panasonic.com/www-cgi/jvcr13pz.cgi?E+PZ+3+AOA0002+ERJ2RKF6800X+7+WW; ComponentLink1Description: http://industrial.panasonic.com/www-cgi/jvcr13pz.cgi?E+PZ+3+AOA0002+ERJ2RKF6800X+7+WW; Resistance (Ohms): 680R
R15 R18 = 620R: RES 620 OHM 1/10W 1% 0402 SMD; Manufacturer: Panasonic Electronic Components; Manufacturer Part Number: ERJ-2RKF6200X; Power (Watts): 0.1W, 1/10W; Temperature Coefficient: ±100ppm/°C; Supplier 1: Digi-Key; Supplier Part Number 1: P620LCT-ND; RoHS: RoHS Compliant; Category: Resistors; Stock 1: 96716; Pricing 1: 1=0.07, 50=0.0128, 100=0.0097, 250=0.0072, 500=0.00532, 1000=0.00355, 5000=0.0025 (GBP); Packaging: Cut Tape (CT); Tolerance: ±1%; Composition: Thick Film; Features: -; Package / Case: 0402 (1005 Metric); Supplier Device Package: 0402; Size / Dimension: 0.039" L x 0.020" W (1.00mm x 0.50mm); Height: 0.016" (0.40mm); Number of Terminations: 2; ComponentLink1URL: http://industrial.panasonic.com/www-cgi/jvcr13pz.cgi?E+PZ+3+AOA0002+ERJ2RKF6200X+7+WW; ComponentLink1Description: http://industrial.panasonic.com/www-cgi/jvcr13pz.cgi?E+PZ+3+AOA0002+ERJ2RKF6200X+7+WW; Resistance (Ohms): 620R
R16 R19 = 300R: RES 300 OHM 1/10W 1% 0402 SMD; Manufacturer: Panasonic Electronic Components; Manufacturer Part Number: ERJ-2RKF3000X; Power (Watts): 0.1W, 1/10W; Temperature Coefficient: ±100ppm/°C; Supplier 1: Digi-Key; Supplier Part Number 1: P300LCT-ND; RoHS: RoHS Compliant; Category: Resistors; Stock 1: 55335; Pricing 1: 1=0.07, 50=0.0128, 100=0.0097, 250=0.0072, 500=0.00532, 1000=0.00355, 5000=0.0025 (GBP); Packaging: Cut Tape (CT); Tolerance: ±1%; Composition: Thick Film; Features: -; Package / Case: 0402 (1005 Metric); Supplier Device Package: 0402; Size / Dimension: 0.039" L x 0.020" W (1.00mm x 0.50mm); Height: 0.016" (0.40mm); Number of Terminations: 2; ComponentLink1URL: http://industrial.panasonic.com/www-cgi/jvcr13pz.cgi?E+PZ+3+AOA0002+ERJ2RKF3000X+7+WW; ComponentLink1Description: http://industrial.panasonic.com/www-cgi/jvcr13pz.cgi?E+PZ+3+AOA0002+ERJ2RKF3000X+7+WW; Supplier 2: Farnell; Supplier Part Number 2: 2302577; Resistance (Ohms): 300R
R53 R54 R65 R66 = 4.7K: RES 4.7K OHM 1/10W 1% 0402 SMD; Manufacturer: Panasonic Electronic Components; Manufacturer Part Number: ERJ-2RKF4701X; Power (Watts): 0.1W, 1/10W; Temperature Coefficient: ±100ppm/°C; Supplier 1: Digi-Key; Supplier Part Number 1: P4.70KLCT-ND; RoHS: RoHS Compliant; Category: Resistors; Stock 1: 1251398; Pricing 1: 1=0.07, 50=0.0128, 100=0.0097, 250=0.0072, 500=0.00532, 1000=0.00355, 5000=0.0025 (GBP); Packaging: Cut Tape (CT); Tolerance: ±1%; Composition: Thick Film; Features: -; Package / Case: 0402 (1005 Metric); Supplier Device Package: 0402; Size / Dimension: 0.039" L x 0.020" W (1.00mm x 0.50mm); Height: 0.016" (0.40mm); Number of Terminations: 2; ComponentLink1URL: http://industrial.panasonic.com/www-cgi/jvcr13pz.cgi?E+PZ+3+AOA0002+ERJ2RKF4701X+7+WW; ComponentLink1Description: http://industrial.panasonic.com/www-cgi/jvcr13pz.cgi?E+PZ+3+AOA0002+ERJ2RKF4701X+7+WW; Resistance (Ohms): 4K7
R56 R57 = 10K: RES 10K OHM 1/10W 1% 0402 SMD; Manufacturer: Panasonic Electronic Components; Manufacturer Part Number: ERJ-2RKF1002X; Power (Watts): 0.1W, 1/10W; Temperature Coefficient: ±100ppm/°C; Supplier 1: Digi-Key; Supplier Part Number 1: P10.0KLCT-ND; RoHS: RoHS Compliant; Category: Resistors; Stock 1: 4805447; Pricing 1: 1=0.07, 50=0.0128, 100=0.0097, 250=0.0072, 500=0.00532, 1000=0.00355, 5000=0.0025 (GBP); Packaging: Cut Tape (CT); Tolerance: ±1%; Composition: Thick Film; Features: -; Package / Case: 0402 (1005 Metric); Supplier Device Package: 0402; Size / Dimension: 0.039" L x 0.020" W (1.00mm x 0.50mm); Height: 0.016" (0.40mm); Number of Terminations: 2; ComponentLink1URL: http://industrial.panasonic.com/www-cgi/jvcr13pz.cgi?E+PZ+3+AOA0002+ERJ2RKF1002X+7+WW; ComponentLink1Description: http://industrial.panasonic.com/www-cgi/jvcr13pz.cgi?E+PZ+3+AOA0002+ERJ2RKF1002X+7+WW; Resistance (Ohms): 10K
R60 = 0R: RES 0.0 OHM 1/10W JUMP 0402 SMD; Manufacturer: Panasonic Electronic Components; Manufacturer Part Number: ERJ-2GE0R00X; Tolerance: Jumper; Power (Watts): 0.1W, 1/10W; Supplier 1: Digi-Key; Supplier Part Number 1: P0.0JCT-ND; RoHS: RoHS Compliant; Category: Resistors; Stock 1: 8025371; Pricing 1: 1=0.07, 50=0.009, 100=0.0069, 250=0.00508, 500=0.00376, 1000=0.00251, 5000=0.00176 (GBP); Packaging: Cut Tape (CT); Composition: Thick Film; Features: -; Temperature Coefficient: -; Package / Case: 0402 (1005 Metric); Supplier Device Package: 0402; Size / Dimension: 0.039" L x 0.020" W (1.00mm x 0.50mm); Height: 0.016" (0.40mm); Number of Terminations: 2; ComponentLink1URL: http://industrial.panasonic.com/www-cgi/jvcr13pz.cgi?E+PZ+3+AOA0001+ERJ2GE0R00X+7+WW; ComponentLink1Description: http://industrial.panasonic.com/www-cgi/jvcr13pz.cgi?E+PZ+3+AOA0001+ERJ2GE0R00X+7+WW; Resistance (Ohms): 0R
R61 = 10.2R: RES 10.2 OHM 1/10W 1% 0402 SMD; Manufacturer: Panasonic Electronic Components; Manufacturer Part Number: ERJ-2RKF10R2X; Power (Watts): 0.1W, 1/10W; Temperature Coefficient: ±100ppm/°C; Supplier 1: Digi-Key; RoHS: RoHS Compliant; Category: Resistors; Stock 1: 45026; Pricing 1: 1=0.07, 50=0.0128, 100=0.0097, 250=0.0072, 500=0.00532, 1000=0.00355, 5000=0.0025 (GBP); Packaging: Cut Tape (CT); Tolerance: ±1%; Composition: Thick Film; Features: -; Package / Case: 0402 (1005 Metric); Supplier Device Package: 0402; Size / Dimension: 0.039" L x 0.020" W (1.00mm x 0.50mm); Height: 0.016" (0.40mm); Number of Terminations: 2; ComponentLink1URL: http://industrial.panasonic.com/www-cgi/jvcr13pz.cgi?E+PZ+3+AOA0002+ERJ2RKF10R2X+7+WW; ComponentLink1Description: http://industrial.panasonic.com/www-cgi/jvcr13pz.cgi?E+PZ+3+AOA0002+ERJ2RKF10R2X+7+WW; Supplier Part Number 1: P10.2LCT-ND; Resistance (Ohms): 10.2R
R62 = 100R: RES 100 OHM 1/10W 1% 0402 SMD; Manufacturer: Panasonic Electronic Components; Manufacturer Part Number: ERJ-2RKF1000X; Power (Watts): 0.1W, 1/10W; Temperature Coefficient: ±100ppm/°C; Supplier 1: Digi-Key; RoHS: RoHS Compliant; Category: Resistors; Stock 1: 3662159; Pricing 1: 1=0.07, 50=0.0128, 100=0.0097, 250=0.0072, 500=0.00532, 1000=0.00355, 5000=0.0025 (GBP); Packaging: Cut Tape (CT); Tolerance: ±1%; Composition: Thick Film; Features: -; Package / Case: 0402 (1005 Metric); Supplier Device Package: 0402; Size / Dimension: 0.039" L x 0.020" W (1.00mm x 0.50mm); Height: 0.016" (0.40mm); Number of Terminations: 2; ComponentLink1URL: http://industrial.panasonic.com/www-cgi/jvcr13pz.cgi?E+PZ+3+AOA0002+ERJ2RKF1000X+7+WW; ComponentLink1Description: http://industrial.panasonic.com/www-cgi/jvcr13pz.cgi?E+PZ+3+AOA0002+ERJ2RKF1000X+7+WW; Supplier Part Number 1: P100LCT-ND; Resistance (Ohms): 100R
R63 = 470R: RES 470 OHM 1/10W 1% 0402 SMD; Manufacturer: Panasonic Electronic Components; Manufacturer Part Number: ERJ-2RKF4700X; Power (Watts): 0.1W, 1/10W; Temperature Coefficient: ±100ppm/°C; Supplier 1: Digi-Key; Supplier Part Number 1: P470LCT-ND; RoHS: RoHS Compliant; Category: Resistors; Stock 1: 454004; Pricing 1: 1=0.07, 50=0.0128, 100=0.0097, 250=0.0072, 500=0.00532, 1000=0.00355, 5000=0.0025 (GBP); Packaging: Cut Tape (CT); Tolerance: ±1%; Composition: Thick Film; Features: -; Package / Case: 0402 (1005 Metric); Supplier Device Package: 0402; Size / Dimension: 0.039" L x 0.020" W (1.00mm x 0.50mm); Height: 0.016" (0.40mm); Number of Terminations: 2; ComponentLink1URL: http://industrial.panasonic.com/www-cgi/jvcr13pz.cgi?E+PZ+3+AOA0002+ERJ2RKF4700X+7+WW; ComponentLink1Description: http://industrial.panasonic.com/www-cgi/jvcr13pz.cgi?E+PZ+3+AOA0002+ERJ2RKF4700X+7+WW; Resistance (Ohms): 470R
RP1 = EXB-N8V681JX: Res Thick Film Array 680 Ohm 5% ±200ppm/C ISOL Molded 8-Pin 0804(4 X 0402) Concave SMD Punched Carrier T/R; Manufacturer: Panasonic / Panasonic ECG; Number of Resistors: 4; Resistance Value: 680 Ohm; Rad Hard: No; Temperature Coefficient: ±200 ppm/°C; Supplier 1: Digikey; Manufacturer Part Number: EXB-N8V681JX; Stock 1: 52666; Pricing 1: 1=0.1, 10=0.075, 25=0.0544, 50=0.0414, 100=0.0305, 250=0.0233, 500=0.0186, 1000=0.0137, 5000=0.0098 (USD); Package Type: SMD; Packaging: Tape & Reel; Number of Terminals: 8; Type: Array; Circuit Designator: ISOL; Technology: Thick Film; Operating Temperature: -55 to 125 °C; ComponentLink1URL: http://media.digikey.com/pdf/Data%20Sheets/Panasonic%20Resistors%20Thermistors%20PDFs/EXB_Series.pdf; ComponentLink1Description: http://media.digikey.com/pdf/Data%20Sheets/Panasonic%20Resistors%20Thermistors%20PDFs/EXB_Series.pdf; ComponentLink2URL: http://www.mouser.com/ds/2/315/panasonic_EXB141824283438-586695.pdf; ComponentLink2Description: http://www.mouser.com/ds/2/315/panasonic_EXB141824283438-586695.pdf; ComponentLink3URL: http://components.arrow.com/part/dataview/41800606S9783363N1386; ComponentLink3Description: http://components.arrow.com/part/dataview/41800606S9783363N1386; ComponentLink4URL: http://www.onlinecomponents.com/datasheet/exb-n8v681jx.aspx?p=44463794; ComponentLink4Description: http://www.onlinecomponents.com/datasheet/exb-n8v681jx.aspx?p=44463794; ComponentLink5URL: http://industrial.panasonic.com/www-data/pdf/AOC0000/AOC0000CE1.pdf; ComponentLink5Description: http://industrial.panasonic.com/www-data/pdf/AOC0000/AOC0000CE1.pdf; Supplier Part Number 1: Y10681CT-ND
RP2 = EXB-N8V621JX: Res Thick Film Array 620 Ohm 5% 200ppm/C ISOL Molded 8-Pin 0804(4 X 0402) Concave SMD Punched Carrier T/R; Manufacturer: Panasonic ECG; Voltage Rating: 50V; Circuit Type: Isolated; Number of Resistors: 4; Power Per Element: 31mW; Temperature Coefficient: 200ppm/°C; Number of Contacts: 8; Voltage Rating (DC): 100V; Supplier 1: Digi-Key; Manufacturer Part Number: EXB-N8V621JX; Stock 1: 7980; Pricing 1: 1=0.1, 10=0.067, 25=0.0464, 50=0.0362, 100=0.0259, 250=0.0202, 500=0.016, 1000=0.0114, 5000=0.0088 (USD); Mount: Surface Mount; Case/Package: 0804; Number of Pins: 8; Number of Terminals: 8; Min Operating Temperature: -55°C; Max Operating Temperature: 125°C; Resistance: 620R; Tolerance: 5%; Packaging: Tape and Reel; Package Quantity: 1; Composition: Thick Film; Termination: SMD/SMT; Length: 0.079inch; Height: 0.022inch; Width: 0.039inch; Terminal Pitch: 0.5mm; Radiation Hardening: No; ComponentLink1URL: http://www.mouser.com/ds/2/315/panasonic_EXB141824283438-586695.pdf; ComponentLink1Description: http://www.mouser.com/ds/2/315/panasonic_EXB141824283438-586695.pdf; ComponentLink2URL: http://www.onlinecomponents.com/datasheet/exb-n8v621jx.aspx?p=44463790; ComponentLink2Description: http://www.onlinecomponents.com/datasheet/exb-n8v621jx.aspx?p=44463790; ComponentLink3URL: http://industrial.panasonic.com/www-data/pdf/AOC0000/AOC0000CE1.pdf; ComponentLink3Description: http://industrial.panasonic.com/www-data/pdf/AOC0000/AOC0000CE1.pdf; ComponentLink4URL: //media.digikey.com/pdf/Data%20Sheets/Panasonic%20Resistors%20Thermistors%20PDFs/EXB_Series.pdf; ComponentLink4Description: //media.digikey.com/pdf/Data%20Sheets/Panasonic%20Resistors%20Thermistors%20PDFs/EXB_Series.pdf; Supplier Part Number 1: Y10621CT-ND
RP3 = EXB-N8V301JX: Res Thick Film Array 300 Ohm 5% 200ppm/C ISOL Molded 8-Pin 0804(4 X 0402) Concave SMD Punched Carrier T/R; Manufacturer: Panasonic / Panasonic ECG; Resistance value: 300; Number of elements: 4; Supplier 1: Digikey; Manufacturer Part Number: EXB-N8V301JX; Stock 1: 2400; Pricing 1: 1=0.1, 10=0.075, 25=0.0544, 50=0.0414, 100=0.0305, 250=0.0233, 500=0.0186, 1000=0.0137, 5000=0.0098 (USD); Tolerance: 5%; Width: 1mm; Temperature coefficient: 200ppm/ C; Height: 0.45mm; Length: 2mm; ComponentLink1URL: http://media.digikey.com/pdf/Data%20Sheets/Panasonic%20Resistors%20Thermistors%20PDFs/EXB_Series.pdf; ComponentLink1Description: http://media.digikey.com/pdf/Data%20Sheets/Panasonic%20Resistors%20Thermistors%20PDFs/EXB_Series.pdf; ComponentLink2URL: http://www.mouser.com/ds/2/315/panasonic_EXB141824283438-586695.pdf; ComponentLink2Description: http://www.mouser.com/ds/2/315/panasonic_EXB141824283438-586695.pdf; ComponentLink3URL: http://www.onlinecomponents.com/datasheet/exb-n8v301jx.aspx?p=44463745; ComponentLink3Description: http://www.onlinecomponents.com/datasheet/exb-n8v301jx.aspx?p=44463745; ComponentLink4URL: http://industrial.panasonic.com/www-data/pdf/AOC0000/AOC0000CE1.pdf; ComponentLink4Description: http://industrial.panasonic.com/www-data/pdf/AOC0000/AOC0000CE1.pdf; Supplier Part Number 1: Y10301DKR-ND
SW1 = DHT-1158: Manufacturer Part Number 1: DHT-1158
SW2 SW3 = SWI TACT SPN0 PANASONIC EVQQ2P03W: PANASONIC - EVQQ2P03W - SWITCH, SPNO, SMD; Switch Function Type: SPST Push; Max Contact Voltage AC: 250; Max Contact Voltage DC: 15; Max Contact Current DC: 20; Supplier 1: Farnell; Manufacturer: PANASONIC; RoHS: YES; Category: Switches & Relays; Stock 1: 3989; Pricing 1: 1=0.38, 50=0.29, 100=0.23 (GBP); Series: EVQQ2; Contact Configuration: SPNO; Terminal Type: SMD; ComponentLink1URL: http://www.farnell.com/datasheets/28111.pdf; ComponentLink1Description: http://www.farnell.com/datasheets/28111.pdf; Supplier Part Number 1: 9962859RL; Manufacturer Part Number: EVQQ2P03W
U8 = LTC4361CDC-1#TRMPBF: LINEAR TECHNOLOGY LTC4361CDC-1#TRMPBF IC, OVERVOLTAGE/CUR PROT, 8DFN; Product Training Modules: LTC4360 LTC4361 LTC4362 Overview; Featured Product: LTC436x Series Overvoltage / Overcurrent Protection Controllers; Internal Switch(s): No; Voltage - Supply: 2.5 V ~ 5.5 V; Dynamic Catalog: Overvoltage, Overcurrent Protection; Other Names: LTC4361CDC-1#TRMPBFCT; Supplier 1: Digikey; Manufacturer: Linear Technology; Manufacturer Part Number: LTC4361CDC-1#TRMPBF; Stock 1: 274; Pricing 1: 1=3.46, 25=3.0904, 100=2.04, 250=1.87 (USD); Standard Package: 1; Category: Integrated Circuits (ICs); Family: PMIC - Hot Swap, PoE Controllers; Series: -; Type: Overvoltage and Overcurrent Controller; Applications: General Purpose; Current Limit: -; Operating Temperature: 0°C ~ 70°C; Mounting Type: Surface Mount; Package / Case: 8-WFDFN Exposed Pad; Supplier Device Package: 8-DFN (2x2); Packaging: Cut Tape (CT); ComponentLink1URL: https://datasheet.ciiva.com/1511/1692593-1511384.pdf; ComponentLink1Description: https://datasheet.ciiva.com/1511/1692593-1511384.pdf; ComponentLink2URL: https://datasheet.ciiva.com/1941/29266-1941720.pdf; ComponentLink2Description: https://datasheet.ciiva.com/1941/29266-1941720.pdf; ComponentLink3URL: https://datasheet.ciiva.com/1941/29266-1941721.pdf; ComponentLink3Description: https://datasheet.ciiva.com/1941/29266-1941721.pdf; ComponentLink4URL: https://datasheet.ciiva.com/1569/1441932-1569140.pdf; ComponentLink4Description: https://datasheet.ciiva.com/1569/1441932-1569140.pdf; ComponentLink5URL: https://datasheet.ciiva.com/1569/1441932-1569141.pdf; ComponentLink5Description: https://datasheet.ciiva.com/1569/1441932-1569141.pdf; ComponentLink6URL: https://datasheet.ciiva.com/1941/29266-1941719.pdf; ComponentLink6Description: https://datasheet.ciiva.com/1941/29266-1941719.pdf; Supplier Part Number 1: LTC4361CDC-1#TRMPBFDKR-ND
U9 U19 = TLV62569DBVR: Variable voltage buck converter; pin to pad: 5>6; Manufacturer: Texas Instruments; Supplier 1: Digi-Key; Manufacturer Part Number: TLV62569DBVR; Stock 1: 4987; Pricing 1: 1=1.32, 10=1.176, 100=0.9168, 500=0.75736, 1000=0.59792 (USD); Case/Package: SOT-23-5; Min Operating Temperature: -40°C; Max Operating Temperature: 125°C; Supplier Part Number 1: 296-47360-6-ND